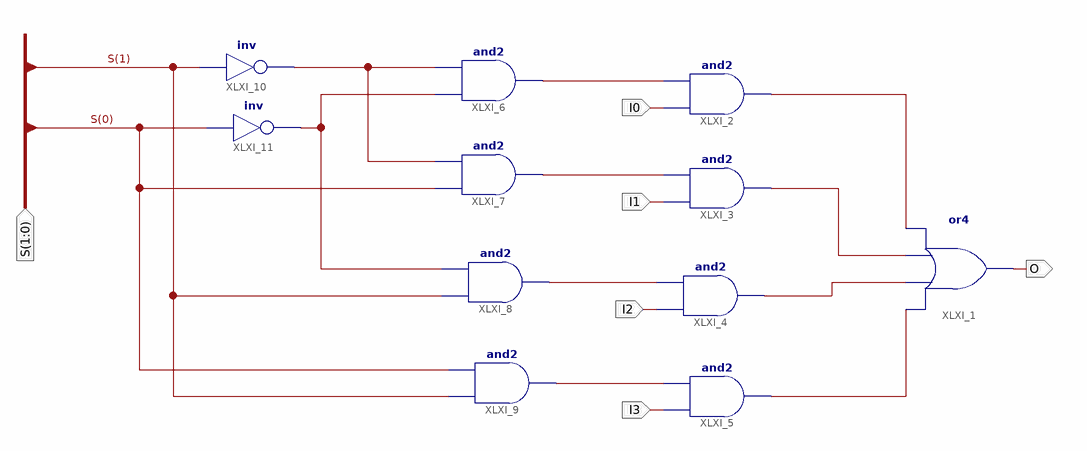
[diagram p0: schematic sheet 1]
// Xilinx ISE schematic MUX4T1.sch (kintex7) as structural Verilog: 11 symbols, 6 ports
module MUX4T1 (
  input  [1:0] S,
  input  I0,
  input  I1,
  input  I2,
  input  I3,
  output O
);

  wire XLXN_1, XLXN_3, XLXN_4, XLXN_5, XLXN_6, XLXN_7, XLXN_8, XLXN_9, XLXN_10, XLXN_12;

  or XLXI_1 (O, XLXN_5, XLXN_4, XLXN_3, XLXN_1);
  and XLXI_2 (XLXN_1, I0, XLXN_6);
  and XLXI_3 (XLXN_3, I1, XLXN_7);
  and XLXI_4 (XLXN_4, I2, XLXN_8);
  and XLXI_5 (XLXN_5, I3, XLXN_9);
  and XLXI_6 (XLXN_6, XLXN_12, XLXN_10);
  and XLXI_7 (XLXN_7, S[0], XLXN_10);
  and XLXI_8 (XLXN_8, S[1], XLXN_12);
  and XLXI_9 (XLXN_9, S[1], S[0]);
  not XLXI_10 (XLXN_10, S[1]);
  not XLXI_11 (XLXN_12, S[0]);
endmodule
